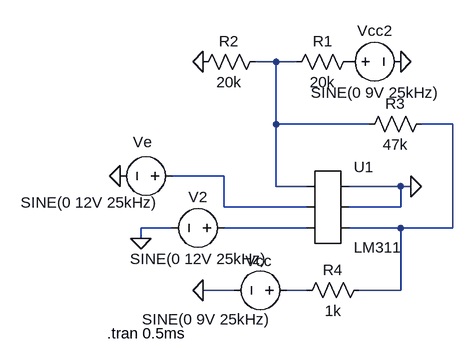
[diagram p0: schematic LM311.asc]
LM311.asc, the LTspice schematic file:
Version 4
SHEET 1 880 680
WIRE -160 -112 -192 -112
WIRE -128 -112 -160 -112
WIRE -160 -16 -160 -112
WIRE -16 -16 -160 -16
WIRE 112 -16 64 -16
WIRE -240 64 -320 64
WIRE -160 80 -160 -16
WIRE -112 80 -160 80
WIRE 32 80 -48 80
WIRE 48 80 32 80
WIRE -240 112 -240 64
WIRE -112 112 -240 112
WIRE 32 112 32 80
WIRE 32 112 -48 112
WIRE -320 144 -368 144
WIRE -112 144 -240 144
WIRE 32 144 -48 144
WIRE 112 144 112 -16
WIRE 112 144 32 144
WIRE -368 160 -368 144
WIRE -224 240 -272 240
WIRE -112 240 -144 240
WIRE 32 240 32 144
WIRE 32 240 -32 240
FLAG -368 160 0
FLAG 48 80 0
FLAG -272 240 0
FLAG -272 -112 0
FLAG 32 -112 0
FLAG -400 64 0
SYMBOL voltage -304 64 R90
WINDOW 0 -52 47 VRight 2
WINDOW 3 41 39 VRight 2
WINDOW 123 0 0 Left 0
WINDOW 39 0 0 Left 0
SYMATTR InstName Ve
SYMATTR Value SINE(0 12V 25kHz)
SYMBOL voltage -224 144 R90
WINDOW 0 -32 56 VBottom 2
WINDOW 3 32 56 VTop 2
WINDOW 123 0 0 Left 0
WINDOW 39 0 0 Left 0
SYMATTR InstName V2
SYMATTR Value SINE(0 12V 25kHz)
SYMBOL AutoGenerated\\LM311 -80 112 R0
SYMATTR InstName U1
SYMBOL res -16 224 R90
WINDOW 0 0 56 VBottom 2
WINDOW 3 32 56 VTop 2
SYMATTR InstName R4
SYMATTR Value 1k
SYMBOL voltage -128 240 R90
WINDOW 0 -45 39 VRight 2
WINDOW 3 45 42 VRight 2
WINDOW 123 0 0 Left 0
WINDOW 39 0 0 Left 0
SYMATTR InstName Vcc
SYMATTR Value SINE(0 9V 25kHz)
SYMBOL res 80 -32 R90
WINDOW 0 0 56 VBottom 2
WINDOW 3 32 56 VTop 2
SYMATTR InstName R3
SYMATTR Value 47k
SYMBOL res -32 -128 R90
WINDOW 0 0 56 VBottom 2
WINDOW 3 32 56 VTop 2
SYMATTR InstName R1
SYMATTR Value 20k
SYMBOL res -176 -128 R90
WINDOW 0 0 56 VBottom 2
WINDOW 3 32 56 VTop 2
SYMATTR InstName R2
SYMATTR Value 20k
SYMBOL voltage -64 -112 R270
WINDOW 0 32 56 VTop 2
WINDOW 3 -32 56 VBottom 2
WINDOW 123 0 0 Left 0
WINDOW 39 0 0 Left 0
SYMATTR InstName Vcc2
SYMATTR Value SINE(0 9V 25kHz)
TEXT -420 306 Left 2 !.tran 0.5ms

The netlist it stands for:
* LM311.asc
Ve N003 0 SINE(0 12V 25kHz)
V2 N004 0 SINE(0 12V 25kHz)
* U1: LM311 (symbol AutoGenerated\LM311 not available, pins judged from their places): pin1=N001 pin2=N003 pin3=N004 pin4=0 pin5=0 pin6=N002
R4 N002 N005 1k
Vcc N005 0 SINE(0 9V 25kHz)
R3 N002 N001 47k
R1 P001 N001 20k
R2 N001 0 20k
Vcc2 P001 0 SINE(0 9V 25kHz)
.tran 0.5ms
.backanno
.end